# Altium schematic sheet TOP.SchDoc: RespiraWorks
size A3; CompanyName: RespiraWorks; DrawnBy: E. Chiu; Organization: Altium; DocumentNumber: 1; Revision: A1; SheetNumber: 1; SheetTotal: 8; PageSetup: Record=PageOptions|CenterHorizontal=True|CenterVertical=True|PrintScale=0.67|XCorrection=1.00|YCorrection=1.00|PrintKind=0|BorderSize=5000000|LeftOffset=0|BottomOffset=0|Orientation=2|PaperLength=1000|PaperWidth=1000|Scale=100|PaperSource=276|PrintQuality=-3|MediaType=1|DitherType=10|PrintScaleMode=1|PaperKind=11"x17" 279.4x431.8mm|PaperIndex=3; ProjectName: FALCON 3S
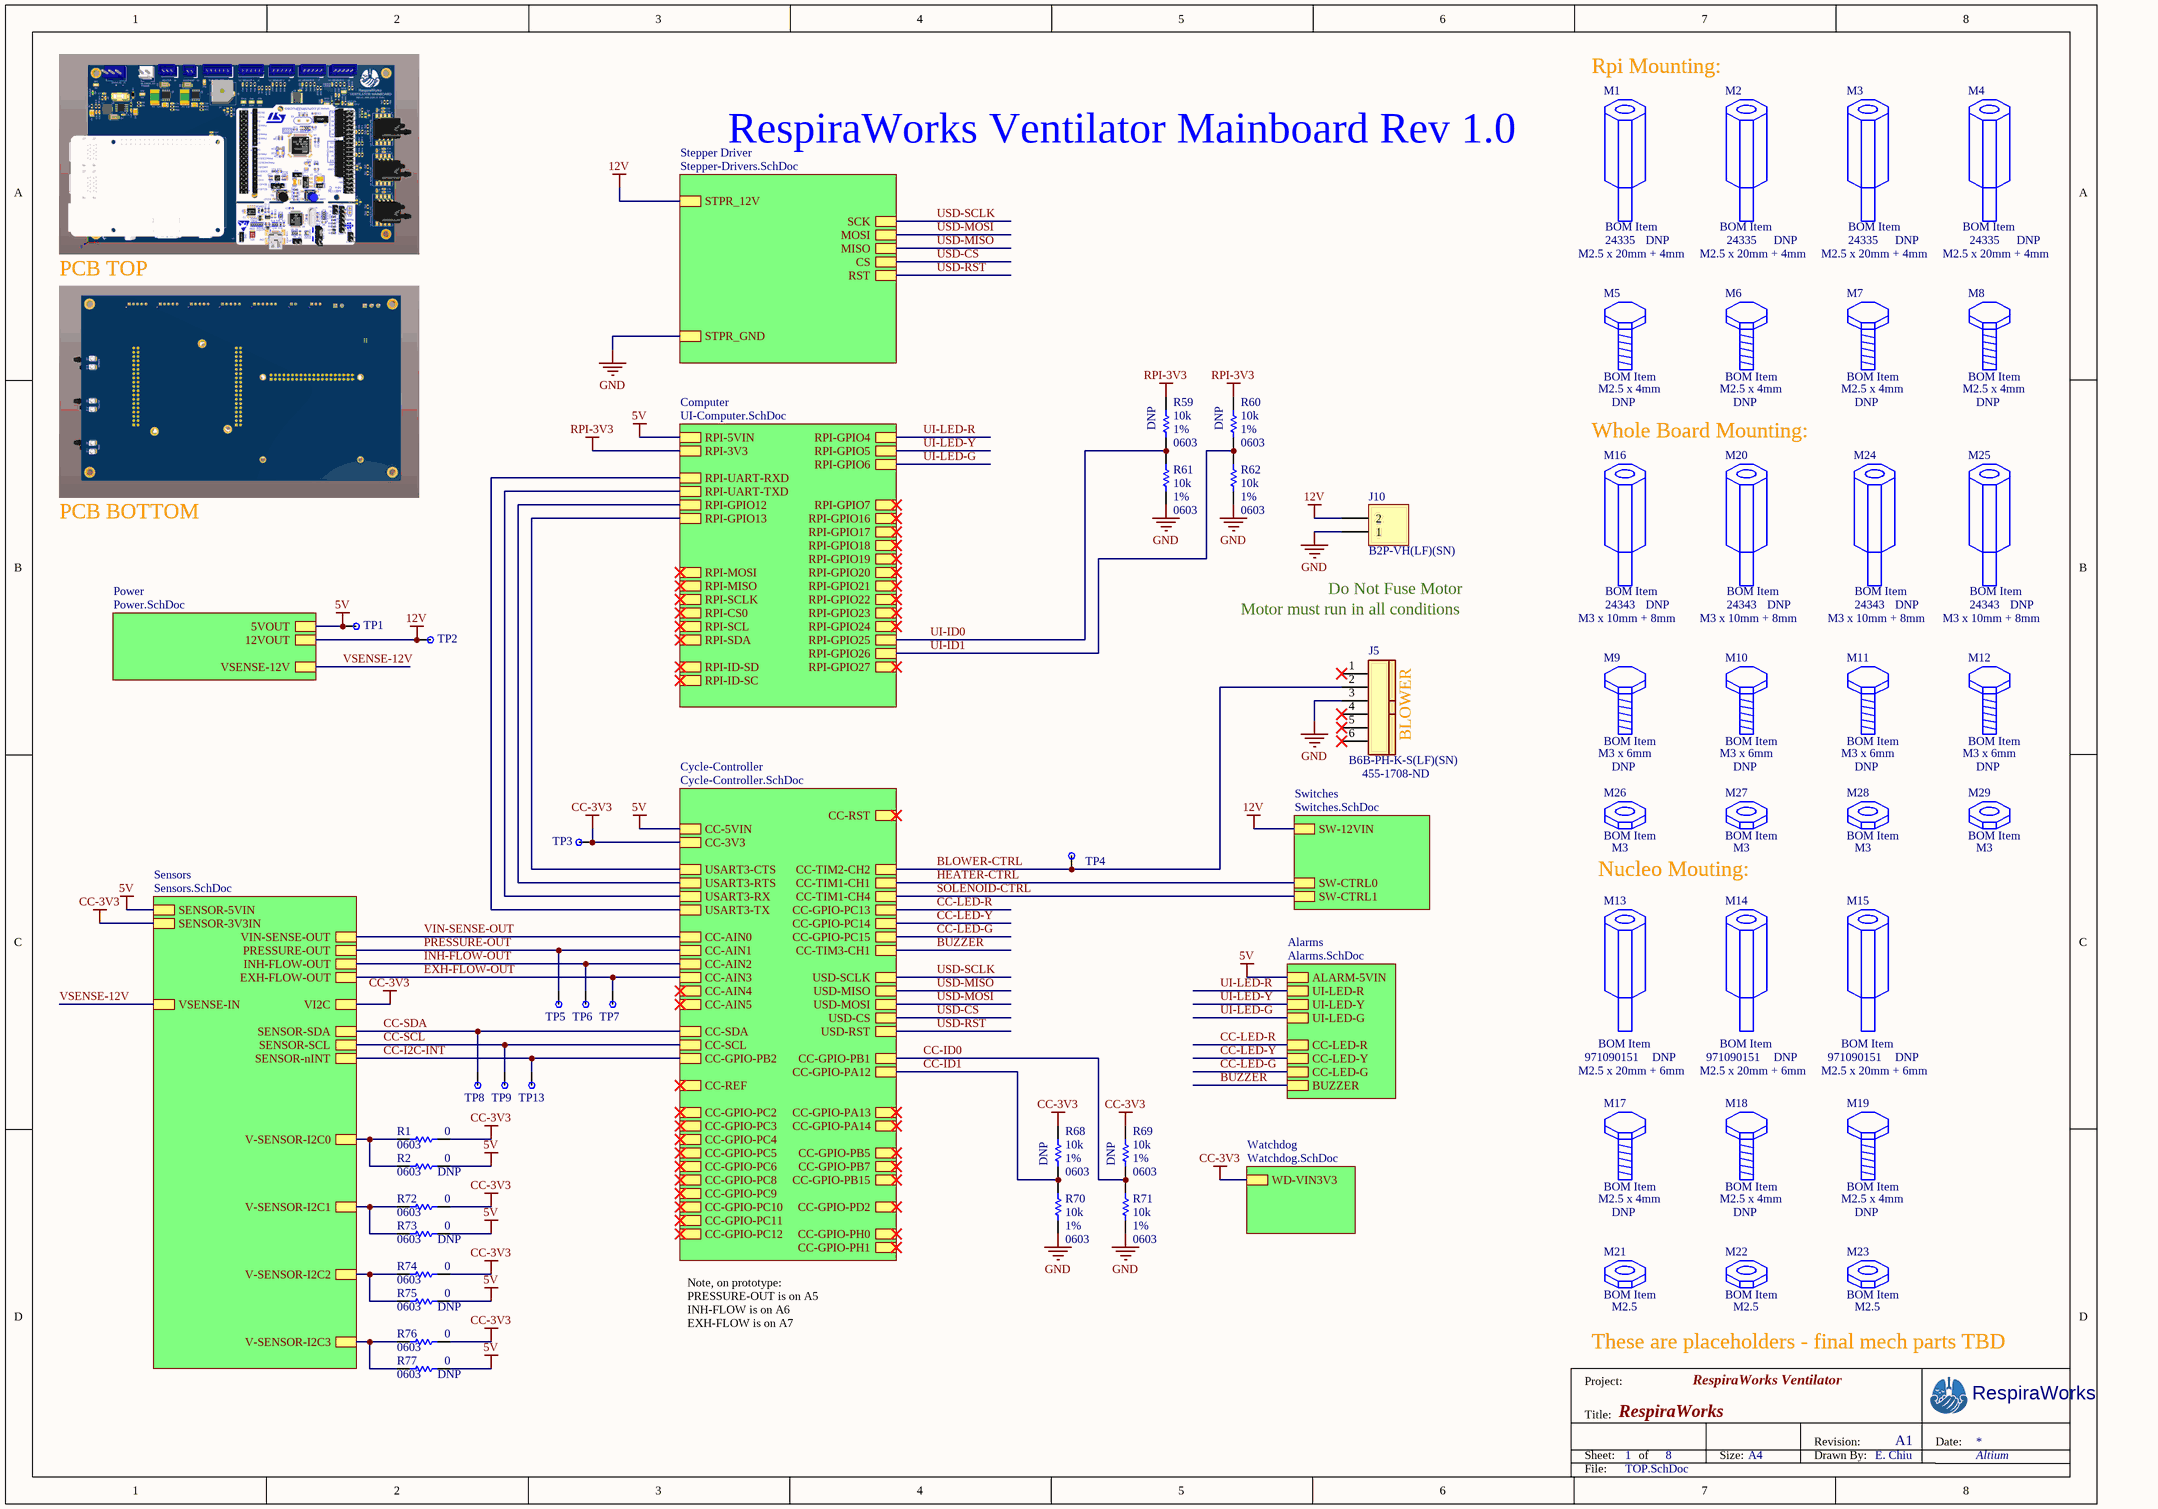
[diagram p0: TOP.SchDoc]

## Parts
J5  B6B-PH-K-S(LF)(SN)  Supplier Part Number 1: 455-1708-ND  [JST_B6B-XH-AM]
J10  B2P-VH(LF)(SN)  [B2P-VH(LF)(SN)]
M1  BOM Item  value M2.5 x 20mm + 4mm  Manufacturer P/N: 24335  Do Not Populate: DNP  (mechanical)
M2  BOM Item  value M2.5 x 20mm + 4mm  Manufacturer P/N: 24335  Do Not Populate: DNP  (mechanical)
M3  BOM Item  value M2.5 x 20mm + 4mm  Manufacturer P/N: 24335  Do Not Populate: DNP  (mechanical)
M4  BOM Item  value M2.5 x 20mm + 4mm  Manufacturer P/N: 24335  Do Not Populate: DNP  (mechanical)
M5  BOM Item  value M2.5 x 4mm  Do Not Populate: DNP  (mechanical)
M6  BOM Item  value M2.5 x 4mm  Do Not Populate: DNP  (mechanical)
M7  BOM Item  value M2.5 x 4mm  Do Not Populate: DNP  (mechanical)
M8  BOM Item  value M2.5 x 4mm  Do Not Populate: DNP  (mechanical)
M9  BOM Item  value M3 x 6mm  Do Not Populate: DNP  (mechanical)
M10  BOM Item  value M3 x 6mm  Do Not Populate: DNP  (mechanical)
M11  BOM Item  value M3 x 6mm  Do Not Populate: DNP  (mechanical)
M12  BOM Item  value M3 x 6mm  Do Not Populate: DNP  (mechanical)
M13  BOM Item  value M2.5 x 20mm + 6mm  Manufacturer P/N: 971090151  Do Not Populate: DNP  (mechanical)
M14  BOM Item  value M2.5 x 20mm + 6mm  Manufacturer P/N: 971090151  Do Not Populate: DNP  (mechanical)
M15  BOM Item  value M2.5 x 20mm + 6mm  Manufacturer P/N: 971090151  Do Not Populate: DNP  (mechanical)
M16  BOM Item  value M3 x 10mm + 8mm  Manufacturer P/N: 24343  Do Not Populate: DNP  (mechanical)
M17  BOM Item  value M2.5 x 4mm  Do Not Populate: DNP  (mechanical)
M18  BOM Item  value M2.5 x 4mm  Do Not Populate: DNP  (mechanical)
M19  BOM Item  value M2.5 x 4mm  Do Not Populate: DNP  (mechanical)
M20  BOM Item  value M3 x 10mm + 8mm  Manufacturer P/N: 24343  Do Not Populate: DNP  (mechanical)
M21  BOM Item  value M2.5  (mechanical)
M22  BOM Item  value M2.5  (mechanical)
M23  BOM Item  value M2.5  (mechanical)
M24  BOM Item  value M3 x 10mm + 8mm  Manufacturer P/N: 24343  Do Not Populate: DNP  (mechanical)
M25  BOM Item  value M3 x 10mm + 8mm  Manufacturer P/N: 24343  Do Not Populate: DNP  (mechanical)
M26  BOM Item  value M3  (mechanical)
M27  BOM Item  value M3  (mechanical)
M28  BOM Item  value M3  (mechanical)
M29  BOM Item  value M3  (mechanical)
R1  value 0  PCB Package: 0603  [RES0603]  (hidden comment: RES 0603)
R2  value 0  PCB Package: 0603  Do Not Populate: DNP  [RES0603]  (hidden comment: RES 0603)
R59  value 10k  PCB Package: 0603  Tolerance: 1%  Do Not Populate: DNP  [RES0603]  (hidden comment: RES 0603)
R60  value 10k  PCB Package: 0603  Tolerance: 1%  Do Not Populate: DNP  [RES0603]  (hidden comment: RES 0603)
R61  value 10k  PCB Package: 0603  Tolerance: 1%  [RES0603]  (hidden comment: RES 0603)
R62  value 10k  PCB Package: 0603  Tolerance: 1%  [RES0603]  (hidden comment: RES 0603)
R68  value 10k  PCB Package: 0603  Tolerance: 1%  Do Not Populate: DNP  [RES0603]  (hidden comment: RES 0603)
R69  value 10k  PCB Package: 0603  Tolerance: 1%  Do Not Populate: DNP  [RES0603]  (hidden comment: RES 0603)
R70  value 10k  PCB Package: 0603  Tolerance: 1%  [RES0603]  (hidden comment: RES 0603)
R71  value 10k  PCB Package: 0603  Tolerance: 1%  [RES0603]  (hidden comment: RES 0603)
R72  value 0  PCB Package: 0603  [RES0603]  (hidden comment: RES 0603)
R73  value 0  PCB Package: 0603  Do Not Populate: DNP  [RES0603]  (hidden comment: RES 0603)
R74  value 0  PCB Package: 0603  [RES0603]  (hidden comment: RES 0603)
R75  value 0  PCB Package: 0603  Do Not Populate: DNP  [RES0603]  (hidden comment: RES 0603)
R76  value 0  PCB Package: 0603  [RES0603]  (hidden comment: RES 0603)
R77  value 0  PCB Package: 0603  Do Not Populate: DNP  [RES0603]  (hidden comment: RES 0603)
TP1  TP-SMT  [TP-5015]  (value not drawn)
TP2  TP-SMT  [TP-5015]  (value not drawn)
TP3  TP-SMT  [TP-5015]  (value not drawn)
TP4  TP-SMT  [TP-5015]  (value not drawn)
TP5  TP-SMT  [TP-5015]  (value not drawn)
TP6  TP-SMT  [TP-5015]  (value not drawn)
TP7  TP-SMT  [TP-5015]  (value not drawn)
TP8  TP-SMT  [TP-5015]  (value not drawn)
TP9  TP-SMT  [TP-5015]  (value not drawn)
TP13  TP-SMT  [TP-5015]  (value not drawn)

## Sub-sheets
Alarms = Alarms.SchDoc: BUZZER, CC-LED-R, UI-LED-Y, CC-LED-G, UI-LED-G, UI-LED-R, CC-LED-Y, ALARM-5VIN
Computer = UI-Computer.SchDoc: RPI-SDA, RPI-SCL, RPI-GPIO6, RPI-GPIO7, RPI-ID-SC, RPI-GPIO12, RPI-GPIO24, RPI-GPIO25, RPI-GPIO4, RPI-GPIO18, RPI-UART-TXD, RPI-GPIO16, RPI-SCLK, RPI-GPIO27, RPI-MOSI, RPI-3V3, RPI-MISO, RPI-GPIO17, RPI-GPIO20, RPI-GPIO23, RPI-GPIO19, RPI-ID-SD, RPI-GPIO22, RPI-GPIO26, RPI-CS0, RPI-UART-RXD, RPI-GPIO13, RPI-GPIO21, RPI-GPIO5, RPI-5VIN
Cycle-Controller = Cycle-Controller.SchDoc: CC-3V3, CC-AIN5, CC-AIN1, CC-TIM2-CH2, CC-AIN2, CC-GPIO-PA12, CC-TIM1-CH1, CC-TIM3-CH1, CC-GPIO-PB1, CC-RST, CC-AIN3, CC-GPIO-PB5, CC-AIN4, CC-AIN0, CC-REF, CC-5VIN, CC-SCL, CC-SDA, USART3-RX, USART3-CTS, USART3-TX, USART3-RTS, CC-GPIO-PC14, CC-GPIO-PC13, CC-GPIO-PC15, CC-GPIO-PB2, CC-TIM1-CH4, CC-GPIO-PC11, CC-GPIO-PC10, CC-GPIO-PC4, CC-GPIO-PB15, CC-GPIO-PC2, CC-GPIO-PC8, CC-GPIO-PC5, CC-GPIO-PH0, CC-GPIO-PC9, CC-GPIO-PC6, CC-GPIO-PH1, CC-GPIO-PC12, CC-GPIO-PD2, CC-GPIO-PC3, CC-GPIO-PA14, CC-GPIO-PA13, CC-GPIO-PB7, USD-SCLK, USD-MISO, USD-MOSI, USD-CS, USD-RST
Power = Power.SchDoc: 5VOUT, VSENSE-12V, 12VOUT
Sensors = Sensors.SchDoc: INH-FLOW-OUT, SENSOR-5VIN, PRESSURE-OUT, EXH-FLOW-OUT, VIN-SENSE-OUT, VSENSE-IN, SENSOR-SDA, V-SENSOR-I2C0, VI2C, SENSOR-nINT, SENSOR-SCL, SENSOR-3V3IN, V-SENSOR-I2C1, V-SENSOR-I2C3, V-SENSOR-I2C2
Stepper Driver = Stepper-Drivers.SchDoc: SCK, CS, MOSI, STPR_GND, STPR_12V, RST, MISO
Switches = Switches.SchDoc: SW-CTRL1, SW-12VIN, SW-CTRL0
Watchdog = Watchdog.SchDoc: WD-VIN3V3

## Nets
5V: R2.2 R73.2 R75.2 R77.2 TP1.1 ; sheet Cycle-Controller/CC-5VIN, sheet Computer/RPI-5VIN, sheet Sensors/SENSOR-5VIN, sheet Alarms/ALARM-5VIN, sheet Power/5VOUT
12V: J10.2 TP2.1 ; sheet Switches/SW-12VIN, sheet Power/12VOUT, sheet Stepper Driver/STPR_12V
CC-3V3: R1.2 R68.2 R69.2 R72.2 R74.2 R76.2 TP3.1 ; sheet Cycle-Controller/CC-3V3, sheet Sensors/VI2C, sheet Sensors/SENSOR-3V3IN, sheet Watchdog/WD-VIN3V3
GND: J5.3 J10.1 R61.1 R62.1 R70.1 R71.1 ; sheet Stepper Driver/STPR_GND
RPI-3V3: R59.2 R60.2 ; sheet Computer/RPI-3V3
BLOWER-CTRL: J5.2 TP4.1 ; sheet Cycle-Controller/CC-TIM2-CH2
BUZZER: sheet Cycle-Controller/CC-TIM3-CH1, sheet Alarms/BUZZER
CC-I2C-INT: TP13.1 ; sheet Cycle-Controller/CC-GPIO-PB2, sheet Sensors/SENSOR-nINT
CC-ID0: R69.1 R71.2 ; sheet Cycle-Controller/CC-GPIO-PB1
CC-ID1: R68.1 R70.2 ; sheet Cycle-Controller/CC-GPIO-PA12
CC-LED-G: sheet Cycle-Controller/CC-GPIO-PC15, sheet Alarms/CC-LED-G
CC-LED-R: sheet Cycle-Controller/CC-GPIO-PC13, sheet Alarms/CC-LED-R
CC-LED-Y: sheet Cycle-Controller/CC-GPIO-PC14, sheet Alarms/CC-LED-Y
CC-SCL: TP9.1 ; sheet Cycle-Controller/CC-SCL, sheet Sensors/SENSOR-SCL
CC-SDA: TP8.1 ; sheet Cycle-Controller/CC-SDA, sheet Sensors/SENSOR-SDA
EXH-FLOW-OUT: TP7.1 ; sheet Cycle-Controller/CC-AIN3, sheet Sensors/EXH-FLOW-OUT
HEATER-CTRL: sheet Cycle-Controller/CC-TIM1-CH1, sheet Switches/SW-CTRL0
INH-FLOW-OUT: TP6.1 ; sheet Cycle-Controller/CC-AIN2, sheet Sensors/INH-FLOW-OUT
PRESSURE-OUT: TP5.1 ; sheet Cycle-Controller/CC-AIN1, sheet Sensors/PRESSURE-OUT
SOLENOID-CTRL: sheet Cycle-Controller/CC-TIM1-CH4, sheet Switches/SW-CTRL1
UI-ID0: R59.1 R61.2 ; sheet Computer/RPI-GPIO25
UI-ID1: R60.1 R62.2 ; sheet Computer/RPI-GPIO26
UI-LED-G: sheet Computer/RPI-GPIO6, sheet Alarms/UI-LED-G
UI-LED-R: sheet Computer/RPI-GPIO4, sheet Alarms/UI-LED-R
UI-LED-Y: sheet Computer/RPI-GPIO5, sheet Alarms/UI-LED-Y
USD-CS: sheet Cycle-Controller/USD-CS, sheet Stepper Driver/CS
USD-MISO: sheet Cycle-Controller/USD-MISO, sheet Stepper Driver/MISO
USD-MOSI: sheet Cycle-Controller/USD-MOSI, sheet Stepper Driver/MOSI
USD-RST: sheet Cycle-Controller/USD-RST, sheet Stepper Driver/RST
USD-SCLK: sheet Cycle-Controller/USD-SCLK, sheet Stepper Driver/SCK
VIN-SENSE-OUT: sheet Cycle-Controller/CC-AIN0, sheet Sensors/VIN-SENSE-OUT
VSENSE-12V: sheet Sensors/VSENSE-IN, sheet Power/VSENSE-12V
NetR1_1: R1.1 R2.1 ; sheet Sensors/V-SENSOR-I2C0
NetR72_1: R72.1 R73.1 ; sheet Sensors/V-SENSOR-I2C1
NetR74_1: R74.1 R75.1 ; sheet Sensors/V-SENSOR-I2C2
NetR76_1: R76.1 R77.1 ; sheet Sensors/V-SENSOR-I2C3
(unnamed): sheet Cycle-Controller/USART3-RX, sheet Computer/RPI-UART-TXD
(unnamed): sheet Cycle-Controller/USART3-CTS, sheet Computer/RPI-GPIO13
(unnamed): sheet Cycle-Controller/USART3-TX, sheet Computer/RPI-UART-RXD
(unnamed): sheet Cycle-Controller/USART3-RTS, sheet Computer/RPI-GPIO12

Not connected (* = marked no-connect by the designer): J5 1* 4* 5* 6*

## Notes on the sheet
- Rpi Mounting:
- (near M1) RespiraWorks Ventilator Mainboard Rev 1.0
- PCB TOP
- Whole Board Mounting:
- PCB BOTTOM
- Motor must run in all conditions
- Do Not Fuse Motor
- (near J5) BLOWER
- Nucleo Mouting:
- Note, on prototype:
  PRESSURE-OUT is on A5
  INH-FLOW is on A6
  EXH-FLOW is on A7
- Project:
- These are placeholders - final mech parts TBD
- RespiraWorks Ventilator
- Title:
- Sheet:
- of
- Size:
- A4
- Drawn By:
- Revision:
- Date:
- File:

## Library data of the parts
J5 = B6B-PH-K-S(LF)(SN): CONN HEADER PH TOP 6POS 2MM; Manufacturer: JST Sales America Inc.; Connector Type: Header, Shrouded; Number of Positions: 6; Number of Positions Loaded: All; Pitch: 0.079" (2.00mm); Supplier 1: Digi-Key; Manufacturer Part Number: B6B-PH-K-S(LF)(SN); RoHS: RoHS Compliant; Category: Connectors, Interconnects; Stock 1: 30111; Pricing 1: 1=0.33, 10=0.313, 100=0.2194, 500=0.18808, 1000=0.15674, 5000=0.13435, 10000=0.12539 (USD); Packaging: Bulk; Part Status: Active; Contact Type: Male Pin; Number of Rows: 1; Row Spacing: -; Contact Mating Length: 0.130" (3.30mm); Mounting Type: Through Hole; Termination: Press-Fit, Solder; Fastening Type: Detent Lock; Features: -; Contact Finish: Tin; Contact Finish Thickness: -; Color: Natural; ComponentLink1URL: http://www.jst-mfg.com/product/pdf/eng/ePH.pdf; ComponentLink1Description: http://www.jst-mfg.com/product/pdf/eng/ePH.pdf; Manufacturer P/N: B6B-PH-K-S(LF)(SN)
J10 = B2P-VH(LF)(SN): JST-VH HEADER VERT 2POS 3.96MM; Manufacturer: JST; Do Not Populate: *; Manufacturer P/N: B2P-VH(LF)(SN)
M1-M4 M16 M20 M24 M25 = STANDOFF: [BOM Item] Generic Standoff; Manufacturer: Keystone
M5-M8 M17-M19 = SCREW: [BOM Item] Generic Nut; Manufacturer: Keystone; Manufacturer P/N: 29300
M9-M12 = SCREW: [BOM Item] Generic Nut; Manufacturer: Keystone; Manufacturer P/N: 29311
M13-M15 = STANDOFF: [BOM Item] Generic Standoff; Manufacturer: Wurth
M21-M23 = NUT: [BOM Item] Generic Nut; Manufacturer: Keystone; Manufacturer P/N: 4707; Do Not Populate: DNP
M26-M29 = NUT: [BOM Item] Generic Nut; Manufacturer: B&F; Manufacturer P/N: MHNZ 003; Do Not Populate: DNP
R1 R2 R72-R77 = RES 0603: Manufacturer P/N: RC0603JR-070RL; Manufacturer: Yageo; Tolerance: 5%
  R1 R72 R74 R76: Do Not Populate: *
R59-R62 R68-R71 = RES 0603: Manufacturer P/N: ERJ-3EKF1002V; Manufacturer: Panasonic
  R61 R62 R70 R71: Do Not Populate: *
TP1-TP9 TP13 = TP-SMT: Keystone 5015 SMT Mini Testpoint; Manufacturer P/N: 5015; Manufacturer: Keystone; PCB Package: TP-5015; Tolerance: 5015; Do Not Populate: *; Value: *